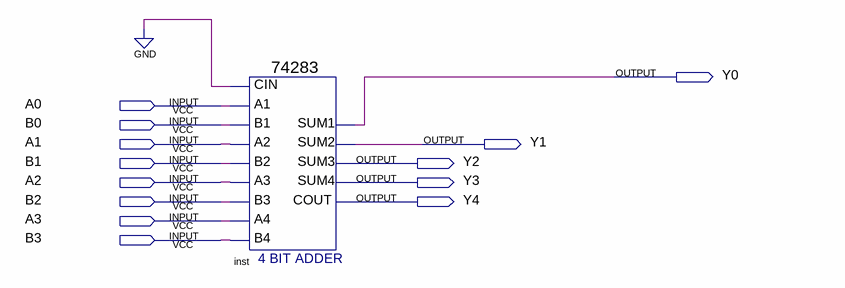
[diagram p0: schematic sheet]
// Quartus schematic a74283a.bdf as structural Verilog: 1 symbols, 13 pins
module a74283a (
  input  A0,
  input  B0,
  input  A1,
  input  B1,
  input  A2,
  input  B2,
  input  A3,
  input  B3,
  output Y0,
  output Y1,
  output Y2,
  output Y3,
  output Y4
);

  \74283  inst (
    .CIN(1'b0), .A1(A0), .A2(A1), .B2(B1), .A3(A2), .A4(A3), .B4(B3), .B1(B0), .B3(B2), .SUM4(Y3), .COUT(Y4),
    .SUM1(Y0), .SUM2(Y1), .SUM3(Y2));
endmodule
